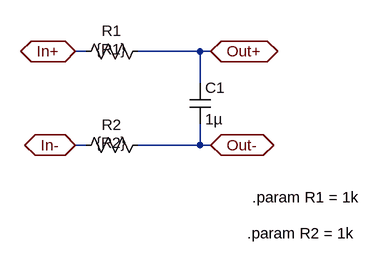
[diagram p0: schematic Test_motif.asc]
Test_motif.asc, the LTspice schematic file:
Version 4
SHEET 1 880 680
WIRE 112 112 96 112
WIRE 288 112 192 112
WIRE 304 112 288 112
WIRE 288 160 288 112
WIRE 112 256 96 256
WIRE 288 256 288 224
WIRE 288 256 192 256
WIRE 304 256 288 256
FLAG 96 112 In+
IOPIN 96 112 BiDir
FLAG 96 256 In-
IOPIN 96 256 BiDir
FLAG 304 112 Out+
IOPIN 304 112 BiDir
FLAG 304 256 Out-
IOPIN 304 256 BiDir
SYMBOL res 208 96 R90
WINDOW 0 0 56 VBottom 2
WINDOW 3 28 56 VBottom 2
SYMATTR InstName R1
SYMATTR Value {R1}
SYMBOL cap 272 160 R0
SYMATTR InstName C1
SYMATTR Value 1µ
SYMBOL res 208 240 R90
WINDOW 0 0 56 VBottom 2
WINDOW 3 28 56 VBottom 2
SYMATTR InstName R2
SYMATTR Value {R2}
TEXT 368 336 Left 2 !.param R1 = 1k
TEXT 360 392 Left 2 !.param R2 = 1k

The netlist it stands for:
* Test_motif.asc
R1 Out+ In+ {R1}
C1 Out+ Out- 1µ
R2 Out- In- {R2}
.param R1 = 1k
.param R2 = 1k
.backanno
.end